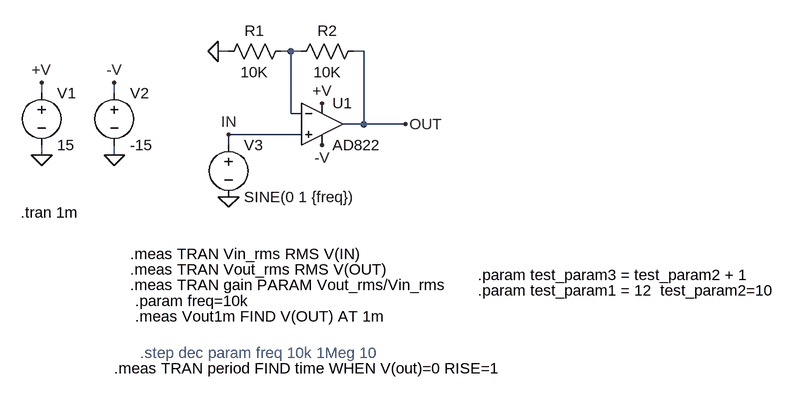
[diagram p0: schematic Batch_Test_Simple.asc]
Batch_Test_Simple.asc, the LTspice schematic file:
Version 4.1
SHEET 1 2320 1456
WIRE 432 -1216 416 -1216
WIRE 528 -1216 512 -1216
WIRE 544 -1216 528 -1216
WIRE 640 -1216 624 -1216
WIRE 144 -1152 144 -1168
WIRE 256 -1152 256 -1168
WIRE 528 -1120 528 -1216
WIRE 544 -1120 528 -1120
WIRE 640 -1104 640 -1216
WIRE 640 -1104 608 -1104
WIRE 704 -1104 640 -1104
WIRE 544 -1088 432 -1088
WIRE 432 -1072 432 -1088
WIRE 144 -1056 144 -1072
WIRE 256 -1056 256 -1072
FLAG 144 -1168 +V
FLAG 144 -1056 0
FLAG 704 -1104 OUT
FLAG 432 -1088 IN
FLAG 576 -1136 +V
FLAG 256 -1168 -V
FLAG 576 -1072 -V
FLAG 416 -1216 0
FLAG 256 -1056 0
FLAG 432 -992 0
SYMBOL voltage 144 -1168 R0
WINDOW 123 0 0 Left 2
WINDOW 39 0 0 Left 2
SYMATTR InstName V1
SYMATTR Value 15
SYMBOL res 528 -1232 R90
WINDOW 0 0 56 VBottom 2
WINDOW 3 32 56 VTop 2
SYMATTR InstName R1
SYMATTR Value 10K
SYMBOL res 640 -1232 R90
WINDOW 0 0 56 VBottom 2
WINDOW 3 32 56 VTop 2
SYMATTR InstName R2
SYMATTR Value 10K
SYMBOL voltage 256 -1168 R0
WINDOW 123 24 146 Left 2
WINDOW 39 24 125 Left 2
SYMATTR InstName V2
SYMATTR Value -15
SYMBOL voltage 432 -1088 R0
WINDOW 123 0 0 Left 0
WINDOW 39 0 0 Left 0
SYMATTR InstName V3
SYMATTR Value SINE(0 1 {freq})
SYMBOL Opamps\\AD822 576 -1168 R0
SYMATTR InstName U1
TEXT 112 -968 Left 2 !.tran 1m
TEXT 280 -880 Left 2 !.meas TRAN Vout_rms RMS V(OUT)
TEXT 280 -904 Left 2 !.meas TRAN Vin_rms RMS V(IN)
TEXT 280 -856 Left 2 !.meas TRAN gain PARAM Vout_rms/Vin_rms
TEXT 288 -832 Left 2 !.param freq=10k
TEXT 288 -808 Left 2 !.meas Vout1m FIND V(OUT) AT 1m
TEXT 256 -728 Left 2 !.meas TRAN period FIND time WHEN V(out)=0 RISE=1
TEXT 816 -872 Left 2 !.param test_param3 = test_param2 + 1
TEXT 816 -848 Left 2 !.param test_param1 = 12  test_param2=10
TEXT 296 -752 Left 2 .step dec param freq 10k 1Meg 10

The netlist it stands for:
* Batch_Test_Simple.asc
V1 +V 0 15
R1 N001 0 10K
R2 OUT N001 10K
V2 -V 0 -15
V3 IN 0 SINE(0 1 {freq})
X§U1 IN N001 +V -V OUT AD822  ; pins In+ In- V+ V- OUT
.tran 1m
.meas TRAN Vout_rms RMS V(OUT)
.meas TRAN Vin_rms RMS V(IN)
.meas TRAN gain PARAM Vout_rms/Vin_rms
.param freq=10k
.meas Vout1m FIND V(OUT) AT 1m
.meas TRAN period FIND time WHEN V(out)=0 RISE=1
.param test_param3 = test_param2 + 1
.param test_param1 = 12  test_param2=10
* .step dec param freq 10k 1Meg 10
.backanno
.end